# EAGLE design stm32 debug adapter (EAGLE 9.1.3)
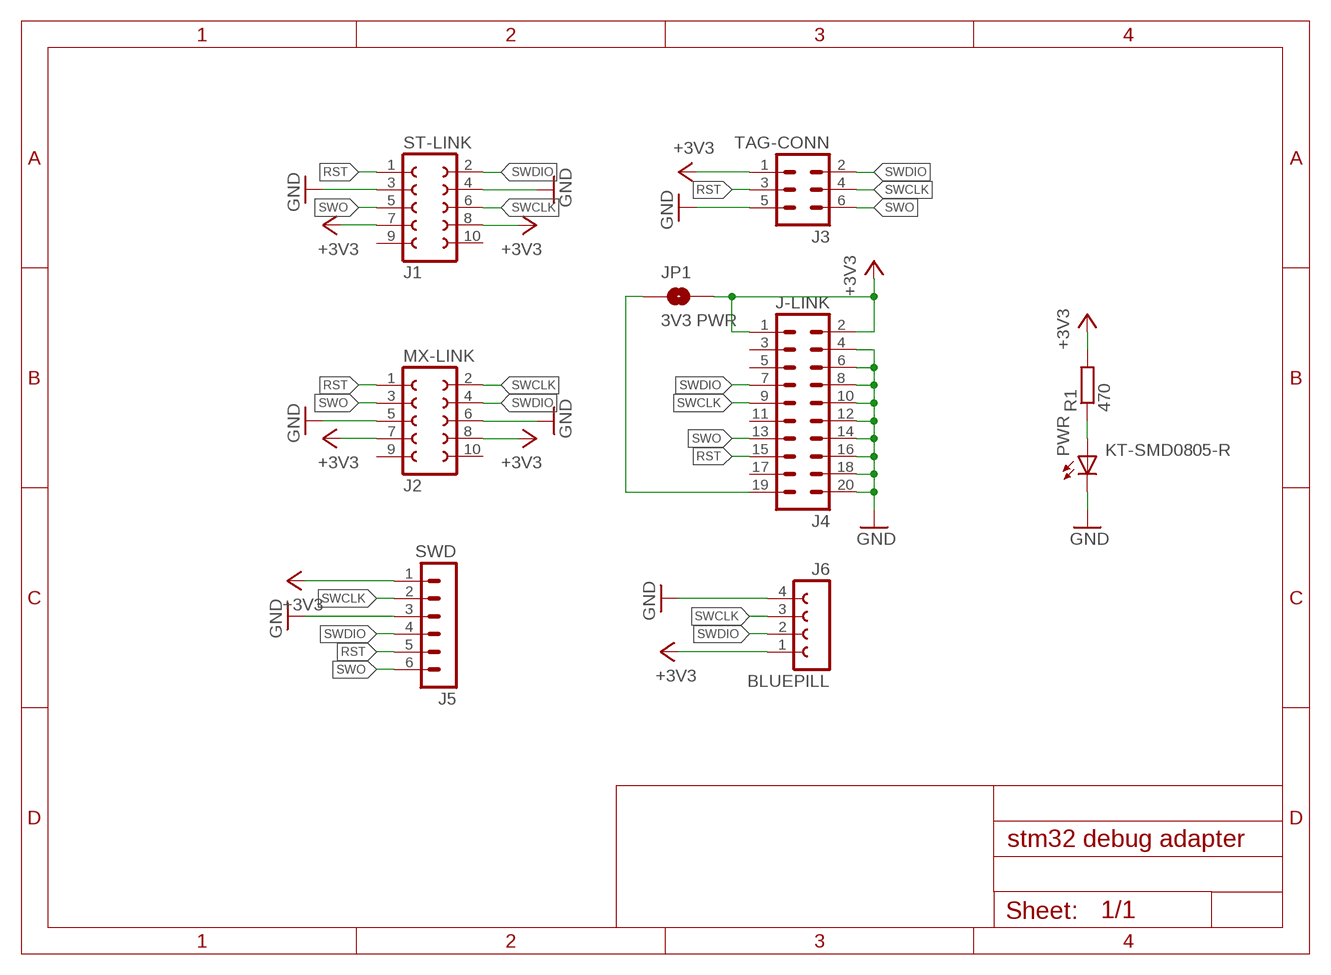
[diagram p0: schematic, sheet 1]

## Parts
J1  ST-LINK  FE05-2W  [FE05-2W]
J2  MX-LINK  FE05-2W  [FE05-2W]
J3  TAG-CONN  ML6  [ML6]
J4  J-LINK  ML20  [ML20]
J5  SWD  MA06-1  [MA06-1]
J6  BLUEPILL  FE04W  [FE04W]
JP1  3V3 PWR  JUMPER-SMT_2_NO_NO-SILK  [SMT-JUMPER_2_NO_NO-SILK]
PWR  KT-SMD0805-R  LEDSML0805  [SML0805]
R1  470  R-EU_R0805  [R0805]

## Nets
3V3PWR: J4.19 JP1.1
+3V3: J1.7 J1.8 J2.7 J2.8 J3.1 J4.1 J4.2 J5.1 J6.1 JP1.2 R1.2
GND: J1.3 J1.4 J2.5 J2.6 J3.5 J4.4 J4.6 J4.8 J4.10 J4.12 J4.14 J4.16 J4.18 J4.20 J5.3 J6.4 PWR.C
N$1: PWR.A R1.1
RST: J1.1 J2.1 J3.3 J4.15 J5.5
SWCLK: J1.6 J2.2 J3.4 J4.9 J5.2 J6.3
SWDIO: J1.2 J2.4 J3.2 J4.7 J5.4 J6.2
SWO: J1.5 J2.3 J3.6 J4.13 J5.6
Unconnected: J1.9 J1.10 J2.9 J2.10 J4.3 J4.5 J4.11 J4.17

## Library data of the parts
J1 J2 = con-lsta:FE05-2W: FEMALE HEADER; OC_FARNELL: unknown; OC_NEWARK: unknown
J3 = con-harting-ml:ML6: HARTING; OC_FARNELL: unknown; OC_NEWARK: unknown
J4 = con-harting-ml:ML20: HARTING; OC_FARNELL: unknown; OC_NEWARK: unknown
J5 = mylib:MA06-1: PIN HEADER; OC_FARNELL: unknown; OC_NEWARK: unknown
J6 = mylib:FE04W: FEMALE HEADER; OC_FARNELL: unknown; OC_NEWARK: unknown
JP1 = SparkFun-Jumpers:JUMPER-SMT_2_NO: Normally open jumper This jumper has two pads in close proximity to each other. Apply solder to close the connection. Round pads are easier to solder for beginners, but are a lot larger. SparkFun Product that uses the round pads: SparkFun EL Sequencer <https://www.sparkfun.com/products/12781>
PWR = led:LED: LED OSRAM: - CHIPLED LG R971, LG N971, LY N971, LG Q971, LY Q971, LO R971, LY R971 LH N974, LH R974 LS Q976, LO Q976, LY Q976 LO Q996 - Hyper CHIPLED LW Q18S LB Q993, LB Q99A, LB R99A - SideLED LS A670, LO A670, LY A670, LG A670, LP A670 LB A673, LV A673, LT A673, LW A673 LH A674 LY A675 LS A676, LA A676, LO A676, LY A676, LW A676 LS A679, LY A679, LG A679 - Hyper Micro SIDELED® LS Y876, LA Y876, LO Y876, LY Y876 LT Y87S - SmartLED LW L88C, LW L88S LB L89C, LB L89S, LG L890 LS L89K, LO L89K, LY L89K LS L896, LA L896, LO L896, LY L896 - TOPLED LS T670, LO T670, LY T670, LG T670, LP T670 LSG T670, LSP T670, LSY T670, LOP T670, LYG T670 LG T671, LOG T671, LSG T671 LB T673, LV T673, LT T673, LW T673 LH T674 LS T676, LA T676, LO T676, LY T676, LB T676, LH T676, LSB T676, LW T676 LB T67C, LV T67C, LT T67C, LS T67K, LO T67K, LY T67K, LW E67C LS E67B, LA E67B, LO E67B, LY E67B, LB E67C, LV E67C, LT E67C LW T67C LS T679, LY T679, LG T679 LS T770, LO T770, LY T770, LG T770, LP T770 LB T773, LV T773, LT T773, LW T773 LH T774 LS E675, LA E675, LY E675, LS T675 LS T776, LA T776, LO T776, LY T776, LB T776 LHGB T686 LT T68C, LB T68C - Hyper Mini TOPLED® LB M676 - Mini TOPLED Santana® LG M470 LS M47K, LO M47K, LY M47K Source: http://www.osram.convergy.de LUXEON: - LUMILED® LXK2-PW12-R00, LXK2-PW12-S00, LXK2-PW14-U00, LXK2-PW14-V00 LXK2-PM12-R00, LXK2-PM12-S00, LXK2-PM14-U00 LXK2-PE12-Q00, LXK2-PE12-R00, LXK2-PE12-S00, LXK2-PE14-T00, LXK2-PE14-U00 LXK2-PB12-K00, LXK2-PB12-L00, LXK2-PB12-M00, LXK2-PB14-N00, LXK2-PB14-P00, LXK2-PB14-Q00 LXK2-PR12-L00, LXK2-PR12-M00, LXK2-PR14-Q00, LXK2-PR14-R00 LXK2-PD12-Q00, LXK2-PD12-R00, LXK2-PD12-S00 LXK2-PH12-R00, LXK2-PH12-S00 LXK2-PL12-P00, LXK2-PL12-Q00, LXK2-PL12-R00 Source: www.luxeon.com KINGBRIGHT: KA-3528ASYC Source: www.kingbright.com
R1 = resistor:R-EU_: RESISTOR, European symbol

## Board
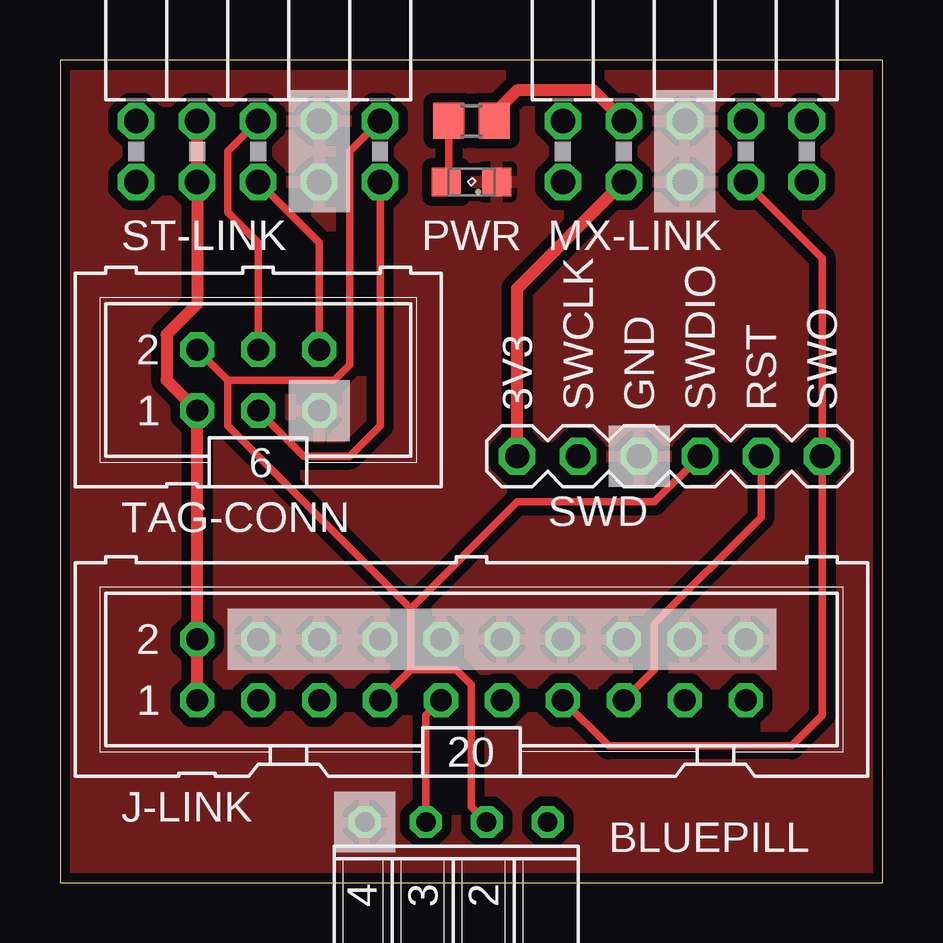
[diagram p1: board, top side]
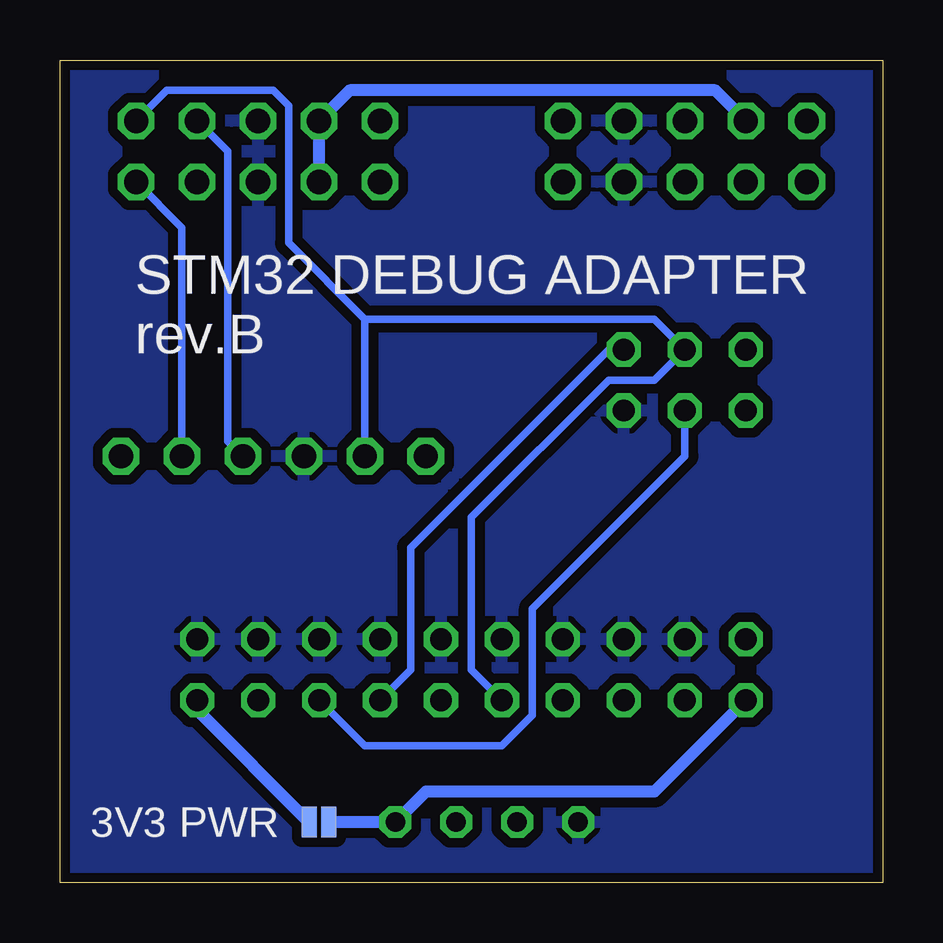
[diagram p2: board, bottom side, seen from below]

Size 34.29 x 34.29 mm. Coordinates in mm from the lower left corner, seen from the top.
Outline: 34.29,0 34.29,34.29 0,34.29 0,0 34.29,0
Copper layers (1*16): Top 0.035mm / dielectric 1.5mm / Bottom 0.035mm
Design rules "SeeedStudio_2layer_DRU_no_angle_20140221": minimum track width 6mil, minimum drill 12mil, track to track 6mil, track to pad 6mil, pad to pad 6mil, via to via 6mil, smd to smd 0mil, copper to edge 10mil, drill to drill 10mil, minimum pad ring 10mil, minimum via ring 6mil, stop-mask expansion 2mil, vias tented up to drill 100mil, thermal gap 10mil

### Footprints (pad centres in the part's own frame; a part is rotated, then mirrored left to right if it is on the bottom)
FE05-2W = drill 1.016 octagon: 1 -5.08,1.27; 2 -5.08,-1.27; 3 -2.54,1.27; 4 -2.54,-1.27; 5 0,1.27; 6 0,-1.27; 7 2.54,1.27; 8 2.54,-1.27; 9 5.08,1.27; 10 5.08,-1.27
ML6 = drill 0.914 octagon: 1 -2.54,-1.27; 2 -2.54,1.27; 3 0,-1.27; 4 0,1.27; 5 2.54,-1.27; 6 2.54,1.27
ML20 = drill 0.914 octagon: 1 -11.43,-1.27; 2 -11.43,1.27; 3 -8.89,-1.27; 4 -8.89,1.27; 5 -6.35,-1.27; 6 -6.35,1.27; 7 -3.81,-1.27; 8 -3.81,1.27; 9 -1.27,-1.27; 10 -1.27,1.27; 11 1.27,-1.27; 12 1.27,1.27; 13 3.81,-1.27; 14 3.81,1.27; 15 6.35,-1.27; 16 6.35,1.27; 17 8.89,-1.27; 18 8.89,1.27; 19 11.43,-1.27; 20 11.43,1.27
MA06-1 = drill 1.016 octagon: 1 -6.35,0; 2 -3.81,0; 3 -1.27,0; 4 1.27,0; 5 3.81,0; 6 6.35,0
FE04W = drill 0.813 octagon: 1 -3.81,0; 2 -1.27,0; 3 1.27,0; 4 3.81,0
SMT-JUMPER_2_NO_NO-SILK = smd 0.635 x 1.27: 1 -0.406,0; 2 0.406,0
SML0805 = smd 1.2 x 1.2: A 1.05,0; C -1.05,0
R0805 = smd 1.3 x 1.5: 1 -0.95,0; 2 0.95,0

### Placement (x,y rotation side)
J1  8.26,30.48 180 top
J2  26.04,30.48 180 top
J3  8.26,20.95 0 top
J4  17.14,8.89 0 top
J5  25.4,17.78 0 top
J6  16.51,2.54 180 top
JP1  23.5,2.54 0 bottom
PWR  17.14,29.21 180 top
R1  17.14,31.75 0 top

### Tracks (layer width: path | path; a pad name or v marks a point on that pad's centre or on a via)
3V3PWR
  Bottom 0.508: JP1.1 28.57,7.21 J4.19
+3V3
  Top 0.508: J4.1 J4.2 J3.1 4.45,20.95 4.45,22.86 5.71,24.13 J1.7 J1.8 | J2.7 19.05,24.77 J5.1 | J2.8 22.23,33.02 19.05,33.02 18.09,32.06 R1.2
  Bottom 0.508: J1.8 6.99,33.02 22.23,33.02 J2.8 J2.7 | J4.1 9.53,3.81 19.05,3.81 J6.1 JP1.2
GND
  pour Top (isolate 0.406): -1.91,35.56 -1.91,-1.27 36.2,-1.27 36.2,35.56
  pour Bottom (isolate 0.406): -3.17,36.83 -3.17,-2.54 37.47,-2.54 37.47,36.83
N$1
  Top 0.305: R1.1 16.2,29.31 PWR.A
RST
  Top 0.305: J3.3 10.16,17.78 12.06,17.78 13.34,19.05 J1.1 | J4.15 24.77,8.89 24.77,10.79 29.21,15.24 J5.5
  Bottom 0.305: J4.15 21.59,5.71 15.88,5.71 14.61,6.99 14.61,11.43 8.26,17.78 J3.3 | J2.1 29.21,27.3 J5.5
SWCLK
  Top 0.305: J1.6 6.99,30.48 6.99,27.94 8.26,26.67 J3.4 | J4.9 15.24,6.99 J6.3
  Bottom 0.305: J4.9 17.14,8.89 17.14,13.97 17.14,15.24 11.43,20.95 9.53,20.95 J3.4 9.53,23.5 21.59,23.5 | 21.59,23.5 J5.2 | J2.2 29.84,33.02 25.4,33.02 24.77,32.38 24.77,26.67 21.59,23.5
SWDIO
  Top 0.305: J3.2 6.99,20.95 | J1.2 12.06,30.48 12.06,25.4 12.06,22.23 12.06,21.59 11.43,20.95 10.16,20.95 8.89,20.95 7.62,20.95 6.99,20.95 | J5.4 24.77,15.88 19.05,15.88 14.61,11.43 | 14.61,8.89 J4.7 | J6.2 17.14,3.17 17.14,8.26 16.51,8.89 14.61,8.89 | 6.99,20.95 6.99,19.05 14.61,11.43 | 14.61,8.89 14.61,11.43
  Bottom 0.305: J2.4 27.3,30.48 27.3,18.41 J5.4
SWO
  Top 0.305: J1.5 10.79,26.67 J3.6 | J4.13 22.86,5.71 30.48,5.71 31.75,6.99 J5.6 31.75,26.04 J2.3
  Bottom 0.305: J4.13 19.68,8.89 19.68,13.97 11.43,22.23 J3.6

### Text on the board
tNames: 3V3 | SWCLK | GND | SWDIO | RST | SWO
bNames: STM32 DEBUG ADAPTER / rev.B